# EAGLE design arduino-pro-mini_2-way-switches_v0.2 (EAGLE 7.2.0)
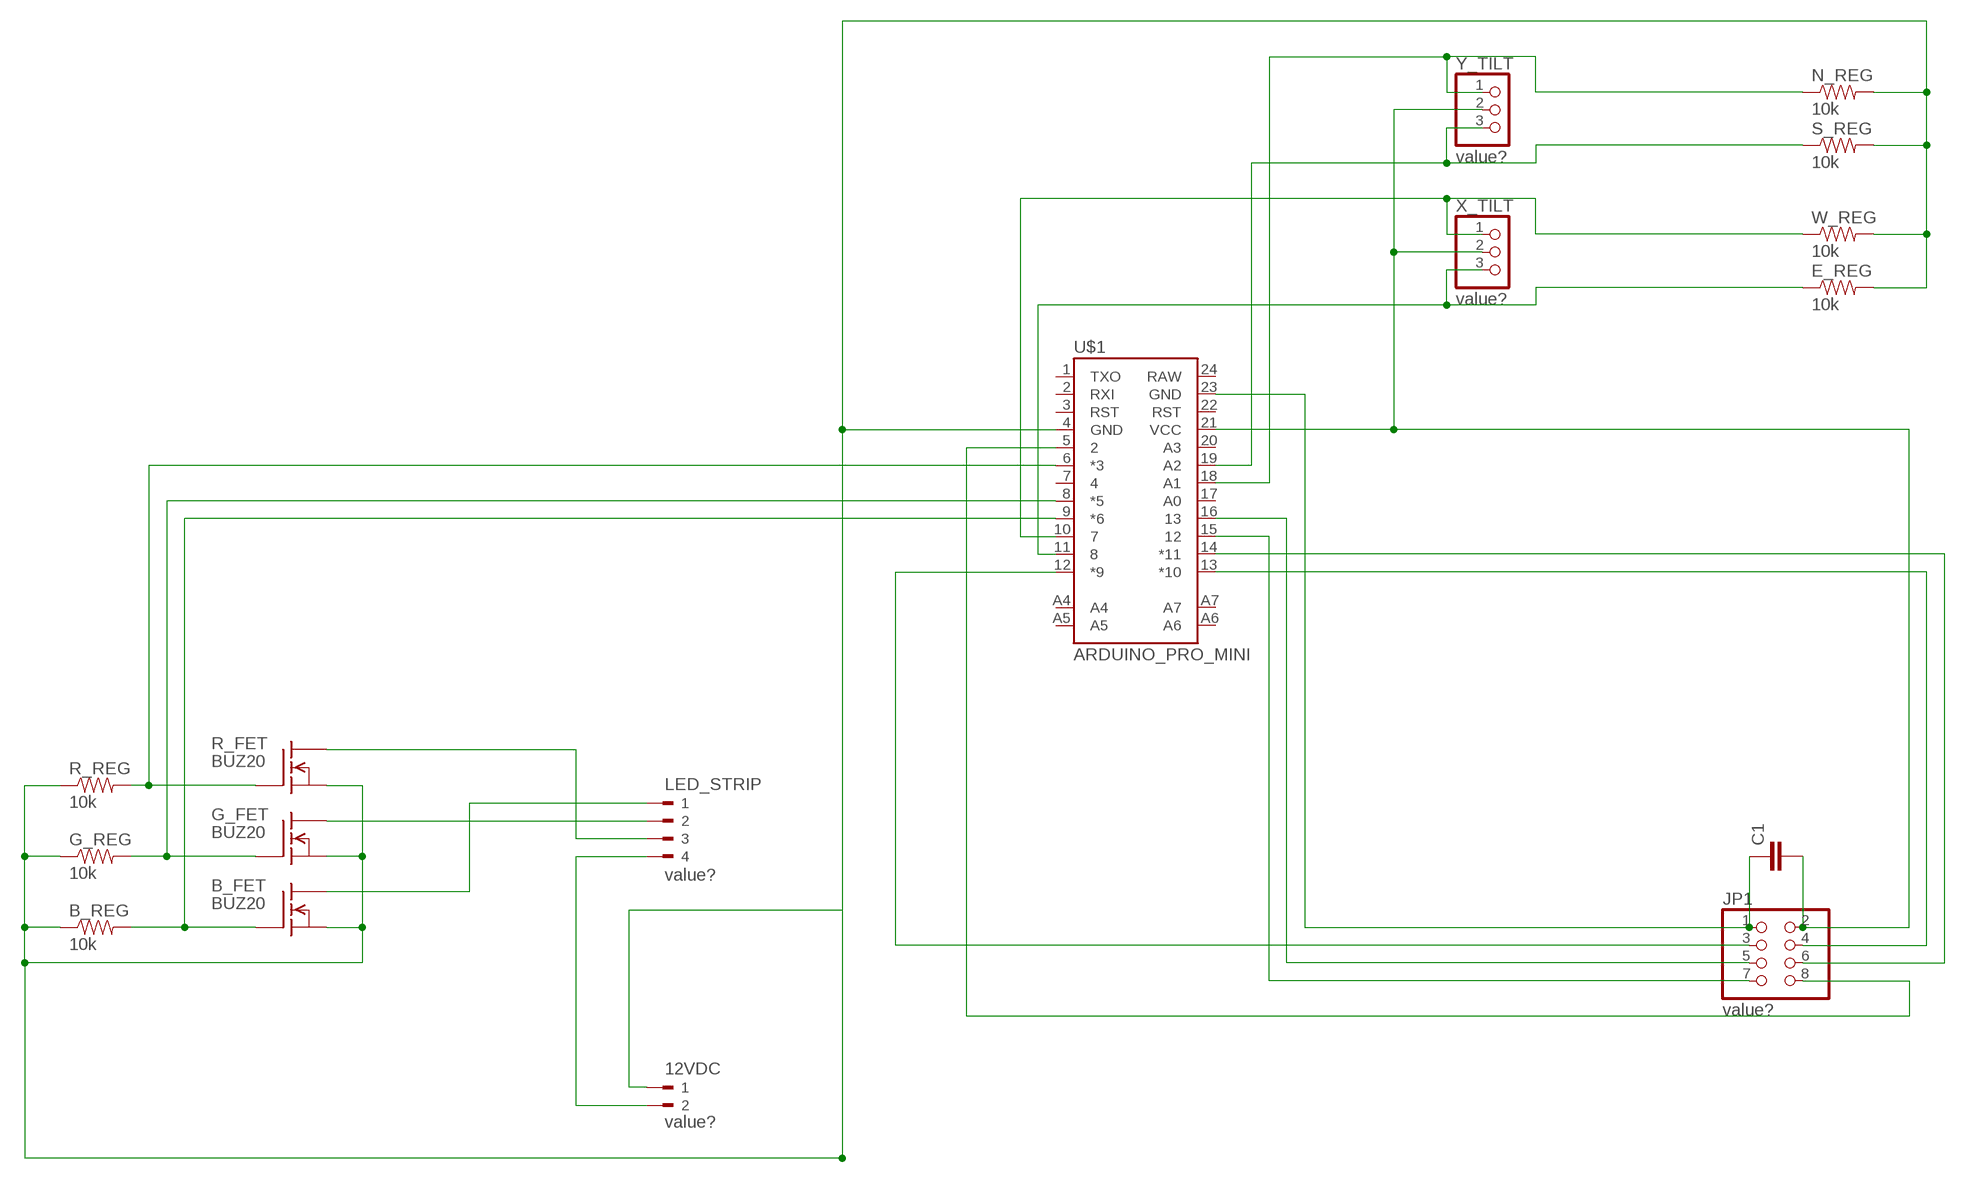
[diagram p0: schematic, sheet 1]

## Parts
12VDC  value?  180-2  [180-2]
B_FET  BUZ20  [TO220]
B_REG  10k  RESISTORPTH-1/4W  [AXIAL-0.4]
C1  CAPPTH  [CAP-PTH-SMALL]
E_REG  10k  RESISTORPTH-1/4W  [AXIAL-0.4]
G_FET  BUZ20  [TO220]
G_REG  10k  RESISTORPTH-1/4W  [AXIAL-0.4]
JP1  value?  PINHD-2X4  [2X04]
LED_STRIP  value?  180-4  [180-4]
N_REG  10k  RESISTORPTH-1/4W  [AXIAL-0.4]
R_FET  BUZ20  [TO220]
R_REG  10k  RESISTORPTH-1/4W  [AXIAL-0.4]
S_REG  10k  RESISTORPTH-1/4W  [AXIAL-0.4]
U$1  ARDUINO_PRO_MINI  [ARDUINO_PRO_MINI]
W_REG  10k  RESISTORPTH-1/4W  [AXIAL-0.4]
X_TILT  value?  PINHD-1X3  [1X03]
Y_TILT  value?  PINHD-1X3  [1X03]

## Nets
N$1: U$1.10 W_REG.P$1 X_TILT.1
N$2: B_FET.1(G) B_REG.P$2 U$1.9(*6)
N$3: R_FET.1(G) R_REG.P$2 U$1.6(*3)
N$5: B_FET.2(D) LED_STRIP.1
N$6: E_REG.P$1 U$1.11 X_TILT.3
N$7: LED_STRIP.3 R_FET.2(D)
N$8: G_FET.2(D) LED_STRIP.2
N$9: 12VDC.2 LED_STRIP.4
N$10: 12VDC.1 B_FET.3(S) B_REG.P$1 E_REG.P$2 G_FET.3(S) G_REG.P$1 N_REG.P$2 R_FET.3(S) R_REG.P$1 S_REG.P$2 U$1.4(GND) W_REG.P$2
N$12: C1.1 JP1.1 U$1.23(GND)
N$13: G_FET.1(G) G_REG.P$2 U$1.8(*5)
N$14: S_REG.P$1 U$1.19(A2) Y_TILT.3
N$15: JP1.3 U$1.12(*9)
N$16: JP1.4 U$1.13(*10)
N$17: JP1.6 U$1.14(*11)
N$21: JP1.7 U$1.15
N$23: JP1.5 U$1.16
N$25: JP1.8 U$1.5
N$27: N_REG.P$1 U$1.18(A1) Y_TILT.1
Y_TILT: C1.2 JP1.2 U$1.21(VCC) X_TILT.2 Y_TILT.2
Unconnected: U$1.1(TXO) U$1.2(RXI) U$1.3(RST) U$1.7 U$1.17(A0) U$1.20(A3) U$1.22(RST) U$1.24(RAW) U$1.A4 U$1.A5 U$1.A6 U$1.A7

## Library data of the parts
12VDC = con-weidmueller-sl35:180-2: WEIDMUELLER CLAMP CONNECTOR; OC_FARNELL: unknown; OC_NEWARK: unknown
B_FET G_FET R_FET = transistor-fet:BUZ20: N-Channel Enhancement MOSFET 100V; 12A; 0,2Ohm
B_REG E_REG G_REG N_REG R_REG S_REG W_REG = SparkFun-Passives:RESISTOR: Resistor Basic schematic elements and footprints for 0603, 1206, and PTH resistors.
C1 = SparkFun-Passives:CAP: Capacitor Standard 0603 ceramic capacitor, and 0.1" leaded capacitor.
JP1 = pinhead:PINHD-2X4: PIN HEADER
LED_STRIP = con-weidmueller-sl35:180-4: WEIDMUELLER CLAMP CONNECTOR; OC_FARNELL: unknown; OC_NEWARK: unknown
U$1 = SparkFun-Boards:ARDUINO_PRO_MINI
X_TILT Y_TILT = pinhead:PINHD-1X3: PIN HEADER

## Board
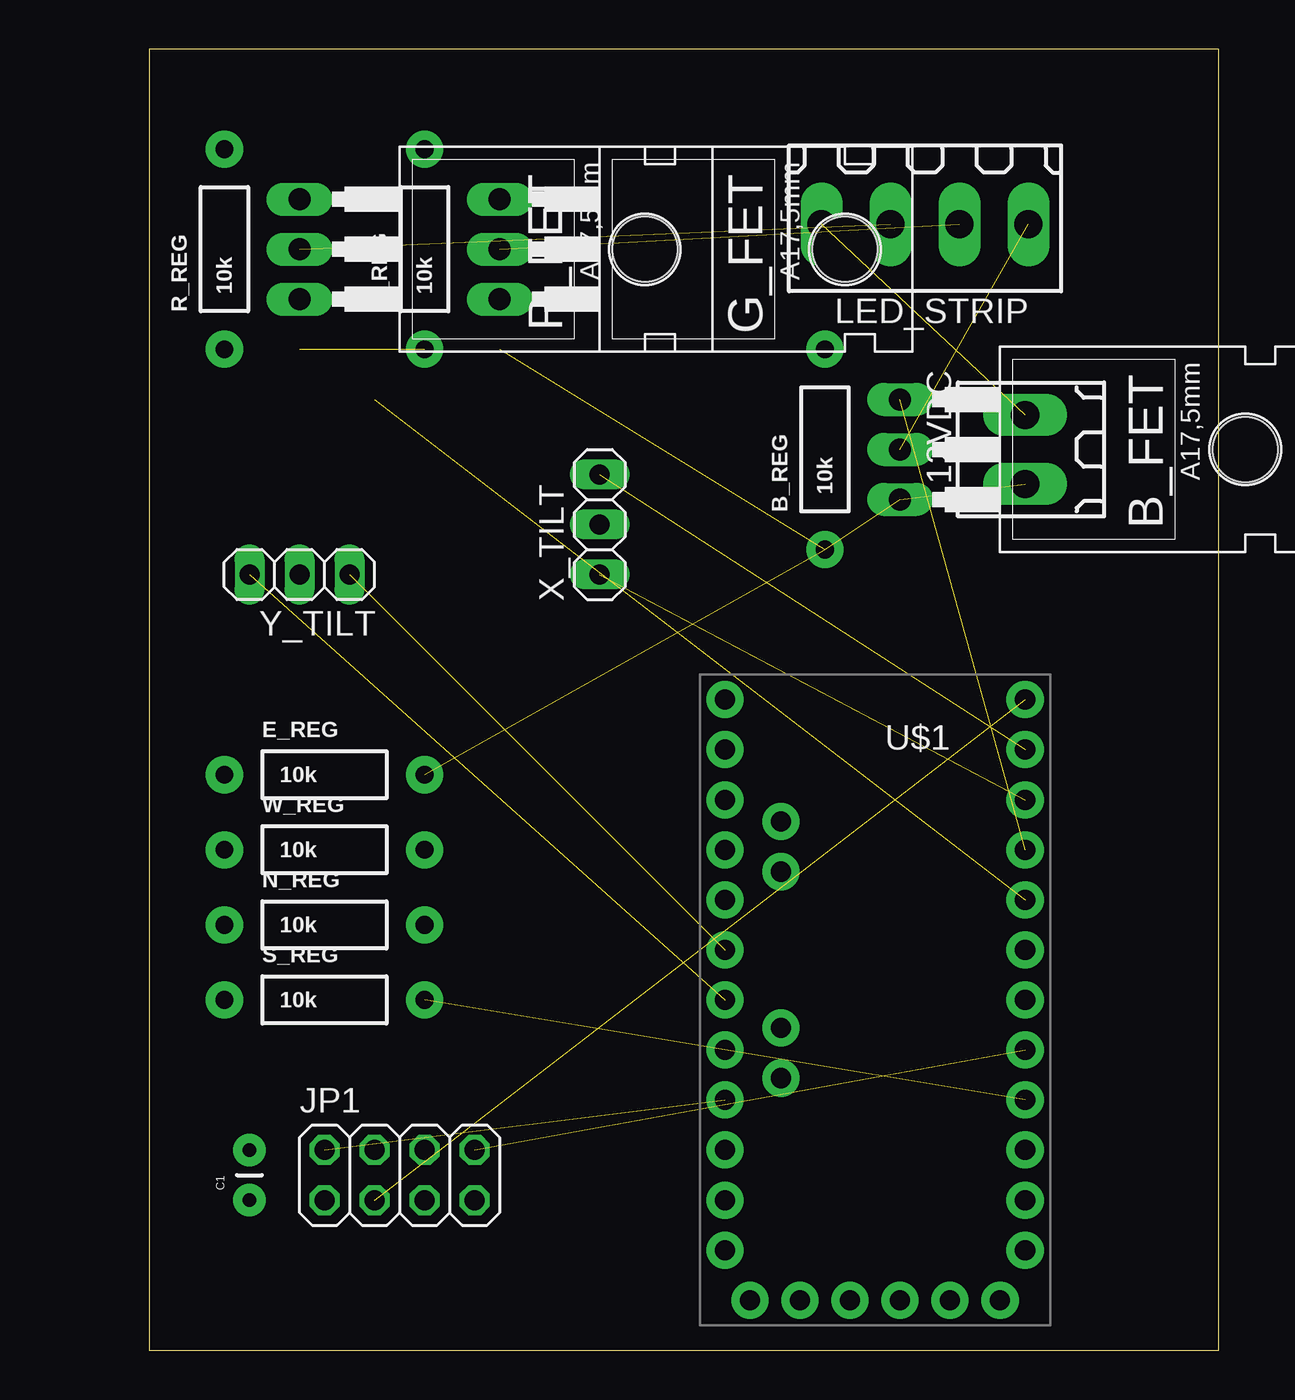
[diagram p1: board, top side]
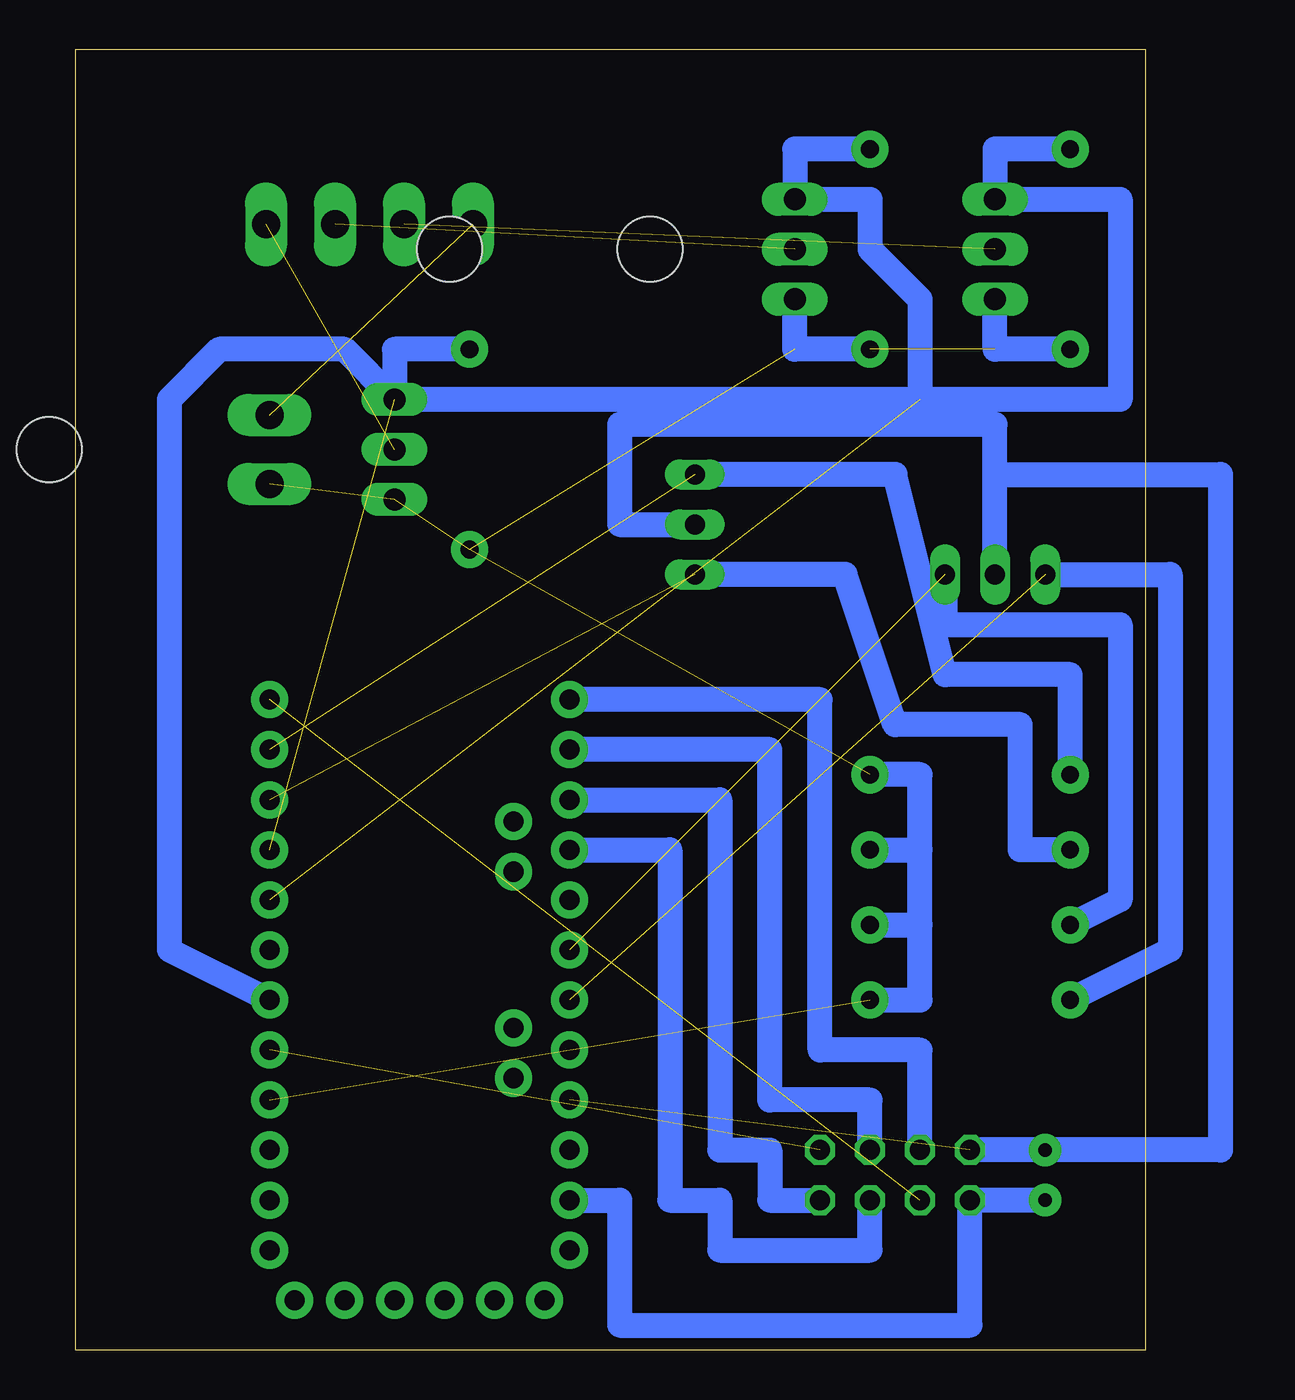
[diagram p2: board, bottom side, seen from below]

Size 54.28 x 66.03 mm. Coordinates in mm from the lower left corner, seen from the top.
Outline: 0,0 54.28,0 54.28,66.03 0,66.03 0,0
Copper layers (1*16): Top 0.035mm / dielectric 1.5mm / Bottom 0.035mm
Design rules "default": minimum track width 10mil, minimum drill 24mil, track to track 8mil, track to pad 8mil, pad to pad 8mil, via to via 8mil, smd to smd 8mil, copper to edge 40mil, drill to drill 8mil, minimum pad ring 10mil, minimum via ring 8mil, stop-mask expansion 4mil, vias tented up to drill 0mil, thermal gap 10mil

### Footprints (pad centres in the part's own frame; a part is rotated, then mirrored left to right if it is on the bottom)
180-2 = drill 1.422 long: 1 -1.75,0; 2 1.75,0
TO220 = drill 1.118 long: 1 -2.54,-6.35; 2 0,-6.35; 3 2.54,-6.35 | hole 3.302: 0,11.176
AXIAL-0.4 = drill 0.9 pad 1.88: P$1 -5.08,0; P$2 5.08,0
CAP-PTH-SMALL = drill 0.7 pad 1.651: 1 0,0; 2 2.54,0
2X04 = drill 1.016 octagon: 1 -3.81,-1.27; 2 -3.81,1.27; 3 -1.27,-1.27; 4 -1.27,1.27; 5 1.27,-1.27; 6 1.27,1.27; 7 3.81,-1.27; 8 3.81,1.27
180-4 = drill 1.422 long: 1 -5.25,0; 2 -1.75,0; 3 1.75,0; 4 5.25,0
ARDUINO_PRO_MINI = drill 1.016 pad 1.88: 1 -7.62,12.7; 2 -7.62,10.16; 3 -7.62,7.62; 4 -7.62,5.08; 5 -7.62,2.54; 6 -7.62,0; 7 -7.62,-2.54; 8 -7.62,-5.08; 9 -7.62,-7.62; 10 -7.62,-10.16; 11 -7.62,-12.7; 12 -7.62,-15.24; 13 7.62,-15.24; 14 7.62,-12.7; 15 7.62,-10.16; 16 7.62,-7.62; 17 7.62,-5.08; 18 7.62,-2.54; 19 7.62,0; 20 7.62,2.54; 21 7.62,5.08; 22 7.62,7.62; 23 7.62,10.16; 24 7.62,12.7; A4 4.763,1.429; A5 4.763,3.969; A6 4.763,-9.049; A7 4.763,-6.509; BLK -6.35,15.24; GND -3.81,15.24; GRN 6.35,15.24; RXI 1.27,15.24; TXO 3.81,15.24; VCC -1.27,15.24
1X03 = drill 1.016 long: 1 -2.54,0; 2 0,0; 3 2.54,0

### Placement (x,y rotation side)
12VDC  44.45,45.72 90 top
B_FET  44.45,45.72 270 top
B_REG  34.29,45.72 90 top
C1  5.08,7.62 90 top
E_REG  8.89,29.21 0 top
G_FET  24.13,55.88 270 top
G_REG  13.97,55.88 90 top
JP1  12.7,8.89 0 top
LED_STRIP  39.37,57.15 180 top
N_REG  8.89,21.59 0 top
R_FET  13.97,55.88 270 top
R_REG  3.81,55.88 90 top
S_REG  8.89,17.78 0 top
U$1  36.83,17.78 180 top
W_REG  8.89,25.4 0 top
X_TILT  22.86,41.91 90 top
Y_TILT  7.62,39.37 180 top

### Tracks (layer width: path | path; a pad name or v marks a point on that pad's centre or on a via)
N$1  (1 unrouted)
  Bottom 1.27: W_REG.P$1 6.35,25.4 6.35,31.75 12.7,31.75 15.24,39.37 X_TILT.1
N$2  (1 unrouted)
  Bottom 1.27: B_REG.P$2 38.1,50.8 B_FET.1
N$3
  Bottom 1.27: R_REG.P$2 7.62,60.96 R_FET.1 1.27,58.42 1.27,48.26 38.1,48.26 40.64,50.8 46.99,50.8 49.53,48.26 49.53,20.32 U$1.6
N$5  (1 unrouted)
N$6  (1 unrouted)
  Bottom 1.27: E_REG.P$1 3.81,34.29 10.16,34.29 12.7,44.45 X_TILT.3
N$7  (1 unrouted)
N$8  (1 unrouted)
N$9  (1 unrouted)
N$10  (6 unrouted)
  Bottom 1.27: R_REG.P$1 7.62,50.8 R_FET.3 | G_REG.P$1 17.78,50.8 G_FET.3 | S_REG.P$2 11.43,17.78 11.43,21.59 | 11.43,21.59 11.43,25.4 | 11.43,25.4 11.43,29.21 E_REG.P$2 | N_REG.P$2 11.43,21.59 | W_REG.P$2 11.43,25.4
N$12
  Bottom 1.27: U$1.23 26.67,7.62 26.67,1.27 8.89,1.27 JP1.1 C1.1
N$13  (1 unrouted)
  Bottom 1.27: G_REG.P$2 17.78,60.96 G_FET.1 13.97,58.42 13.97,55.88 11.43,53.34 11.43,48.26
N$14  (1 unrouted)
  Bottom 1.27: Y_TILT.3 -1.27,39.37 -1.27,20.32 S_REG.P$1
N$15  (1 unrouted)
N$16
  Bottom 1.27: JP1.4 11.43,15.24 16.51,15.24 16.51,33.02 U$1.13
N$17
  Bottom 1.27: JP1.6 13.97,12.7 19.05,12.7 19.05,30.48 U$1.14
N$21
  Bottom 1.27: U$1.15 21.59,27.94 21.59,10.16 19.05,10.16 19.05,7.62 JP1.7
N$23
  Bottom 1.27: U$1.16 24.13,25.4 24.13,7.62 21.59,7.62 21.59,5.08 13.97,5.08 JP1.5
N$25  (1 unrouted)
N$27  (1 unrouted)
  Bottom 1.27: Y_TILT.1 10.16,36.83 1.27,36.83 1.27,22.86 N_REG.P$1
Y_TILT  (1 unrouted)
  Bottom 1.27: JP1.2 C1.2 -3.81,10.16 -3.81,44.45 7.62,44.45 | 7.62,44.45 7.62,46.99 26.67,46.99 26.67,41.91 X_TILT.2 | Y_TILT.2 7.62,44.45